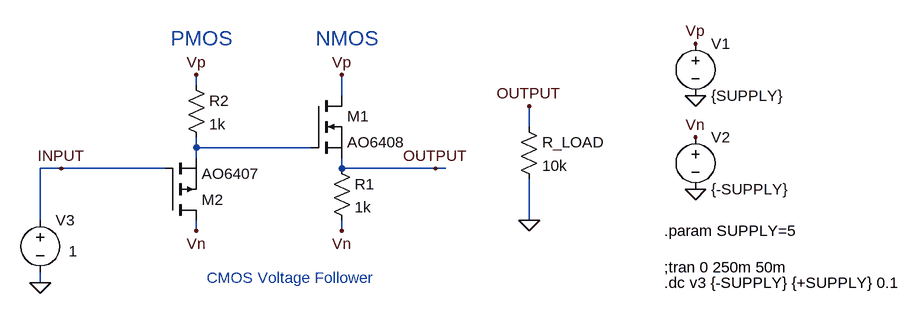
[diagram p0: schematic Week12_CMOS_Voltage_Follower.asc]
Week12_CMOS_Voltage_Follower.asc, the LTspice schematic file:
Version 4
SHEET 1 1548 700
WIRE 432 48 432 32
WIRE 656 64 656 32
WIRE 944 112 944 80
WIRE 432 144 432 128
WIRE 608 144 432 144
WIRE 432 160 432 144
WIRE 224 176 192 176
WIRE 384 176 224 176
WIRE 656 176 656 160
WIRE 800 176 656 176
WIRE 816 176 800 176
WIRE 192 256 192 176
WIRE 944 256 944 192
WIRE 432 272 432 256
WIRE 656 272 656 256
WIRE 192 352 192 336
FLAG 1200 64 0
FLAG 1200 208 0
FLAG 192 352 0
FLAG 1200 -16 Vp
FLAG 1200 128 Vn
FLAG 432 272 Vn
FLAG 432 32 Vp
FLAG 656 32 Vp
FLAG 656 272 Vn
FLAG 224 176 INPUT
FLAG 800 176 OUTPUT
FLAG 944 80 OUTPUT
FLAG 944 256 0
SYMBOL voltage 1200 -32 R0
WINDOW 123 0 0 Left 0
WINDOW 39 0 0 Left 0
SYMATTR InstName V1
SYMATTR Value {SUPPLY}
SYMBOL voltage 1200 112 R0
WINDOW 123 0 0 Left 0
WINDOW 39 0 0 Left 0
SYMATTR InstName V2
SYMATTR Value {-SUPPLY}
SYMBOL voltage 192 240 R0
WINDOW 3 44 63 Left 2
WINDOW 123 0 0 Left 0
WINDOW 39 0 0 Left 0
SYMATTR Value 1
SYMATTR InstName V3
SYMBOL res 640 160 R0
SYMATTR InstName R1
SYMATTR Value 1k
SYMBOL res 416 32 R0
SYMATTR InstName R2
SYMATTR Value 1k
SYMBOL pmos 384 256 M180
SYMATTR InstName M2
SYMATTR Value AO6407
SYMBOL nmos 608 64 R0
SYMATTR InstName M1
SYMATTR Value AO6408
SYMBOL res 928 96 R0
SYMATTR InstName R_LOAD
SYMATTR Value 10k
TEXT 1152 328 Left 2 !;tran 0 250m 50m
TEXT 448 344 Left 2 ;CMOS Voltage Follower
TEXT 1152 352 Left 2 !.dc v3 {-SUPPLY} {+SUPPLY} 0.1
TEXT 440 -24 Center 3 ;PMOS
TEXT 664 -24 Center 3 ;NMOS
TEXT 1152 272 Left 2 !.param SUPPLY=5

The netlist it stands for:
* Week12_CMOS_Voltage_Follower.asc
V1 Vp 0 {SUPPLY}
V2 Vn 0 {-SUPPLY}
V3 INPUT 0 1
R1 OUTPUT Vn 1k
R2 Vp N001 1k
M2 Vn INPUT N001 N001 AO6407
M1 Vp N001 OUTPUT OUTPUT AO6408
R_LOAD OUTPUT 0 10k
.model NMOS NMOS
.model PMOS PMOS
.lib standard.mos
;tran 0 250m 50m
* CMOS Voltage Follower
.dc v3 {-SUPPLY} {+SUPPLY} 0.1
* PMOS
* NMOS
.param SUPPLY=5
.backanno
.end